# Altium schematic sheet Az_Proj.SchDoc
size A
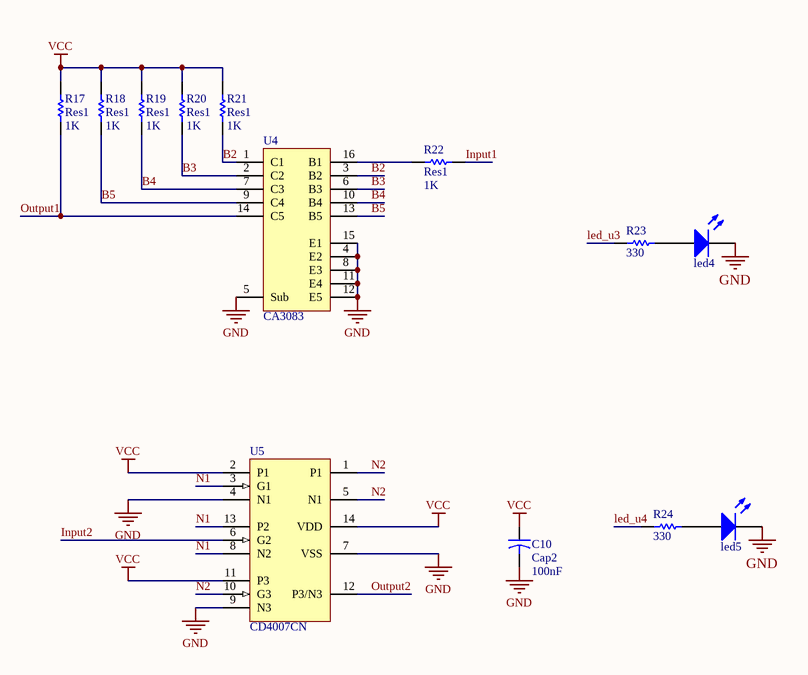
[diagram p0: Az_Proj.SchDoc]

## Parts
C10  Cap2  value 100nF  [My_cap100n]
led4  LED 5mm  [LED-5mm]  (value not drawn)
led5  LED 5mm  [LED-5mm]  (value not drawn)
R17  Res1  value 1K  [AXIAL-0.3]
R18  Res1  value 1K  [AXIAL-0.3]
R19  Res1  value 1K  [AXIAL-0.3]
R20  Res1  value 1K  [AXIAL-0.3]
R21  Res1  value 1K  [AXIAL-0.3]
R22  Res1  value 1K  [AXIAL-0.3]
R23  value 330  [AXIAL-0.3]  (hidden comment: Res1)
R24  value 330  [AXIAL-0.3]  (hidden comment: Res1)
U4  CA3083  [DIP16]
U5  CD4007CN  [DIP14]

## Nets
GND: C10.2 led4.2(K) led5.2(K) U4.4(E2) U4.5(Sub) U4.8(E3) U4.11(E4) U4.12(E5) U4.15(E1) U5.4(N1) U5.7(VSS) U5.9(N3)
VCC: C10.1 R17.2 R18.2 R19.2 R20.2 R21.2 U5.2(P1) U5.11(P3) U5.14(VDD)
B2: R21.1 U4.1(C1) U4.3(B2)
B3: R20.1 U4.2(C2) U4.6(B3)
B4: R19.1 U4.7(C3) U4.10(B4)
B5: R18.1 U4.9(C4) U4.13(B5)
Input1: R22.2
Input2: U5.6(G2)
led_u3: R23.1
led_u4: R24.1
N1: U5.3(G1) U5.8(N2) U5.13(P2)
N2: U5.1(P1) U5.5(N1) U5.10(G3)
Output1: R17.1 U4.14(C5)
Output2: U5.12(P3/N3)
Netled4_1: led4.1(A) R23.2
Netled5_1: led5.1(A) R24.2
NetR22_1: R22.1 U4.16(B1)

## Library data of the parts
C10 = Cap2: Capacitor; Published: 23-Sep-2002; PackageReference: CAPR5-4X5; Publisher: Altium Limited; PackageDescription: Capacitor; 2 Leads
led4 led5 = LED 5mm: Typical LED; Designer: Seyed Mohsen Ghasemian; Published: 07/31/2012; PackageReference: LED; Publisher: www.picpars.com; PackageDescription: LED; 2 Leads
R17-R24 = Res1: Resistor; Published: 8-Jun-2000; LatestRevisionDate: 17-Jul-2002; LatestRevisionNote: Re-released for DXP Platform.; PackageReference: AXIAL-0.3; Publisher: Altium Limited; PackageDescription: Axial Device, Thru-Hole; 2 Leads; 0.3 in Pin Spacing
U5 = CD4007CN: Dual Complementary Pair Plus Inverter; Published: 17-Jul-2002; LatestRevisionDate: 29-May-2009; LatestRevisionNote: Component Body Added.; DatasheetVersion: Jan-1999; PackageVersion: 2000; PackageReference: N14A; Publisher: Altium Limited; PackageDescription: DIP, 14-Pin, Row Spacing 7.62 mm, Pitch 2.54 mm; ComponentLink1Description: Manufacturer Link; ComponentLink1URL: http://www.fairchildsemi.com/